# EasyEDA Pro project ProPrj_super_cap_ctrl_v1.0_2025-02-24.epro, schematic 控制原理图

## Sheets
1 MCU: Board Name: 控制下板v1.0; Create Date: 2024-10-04; Page Name: MCU; Project Name: h桥电路test_v1.0; Schematic Name: 控制原理图; Update Date: 2024-10-04; Company: 嘉立创EDA; Page Size: A4; Version: V1.0
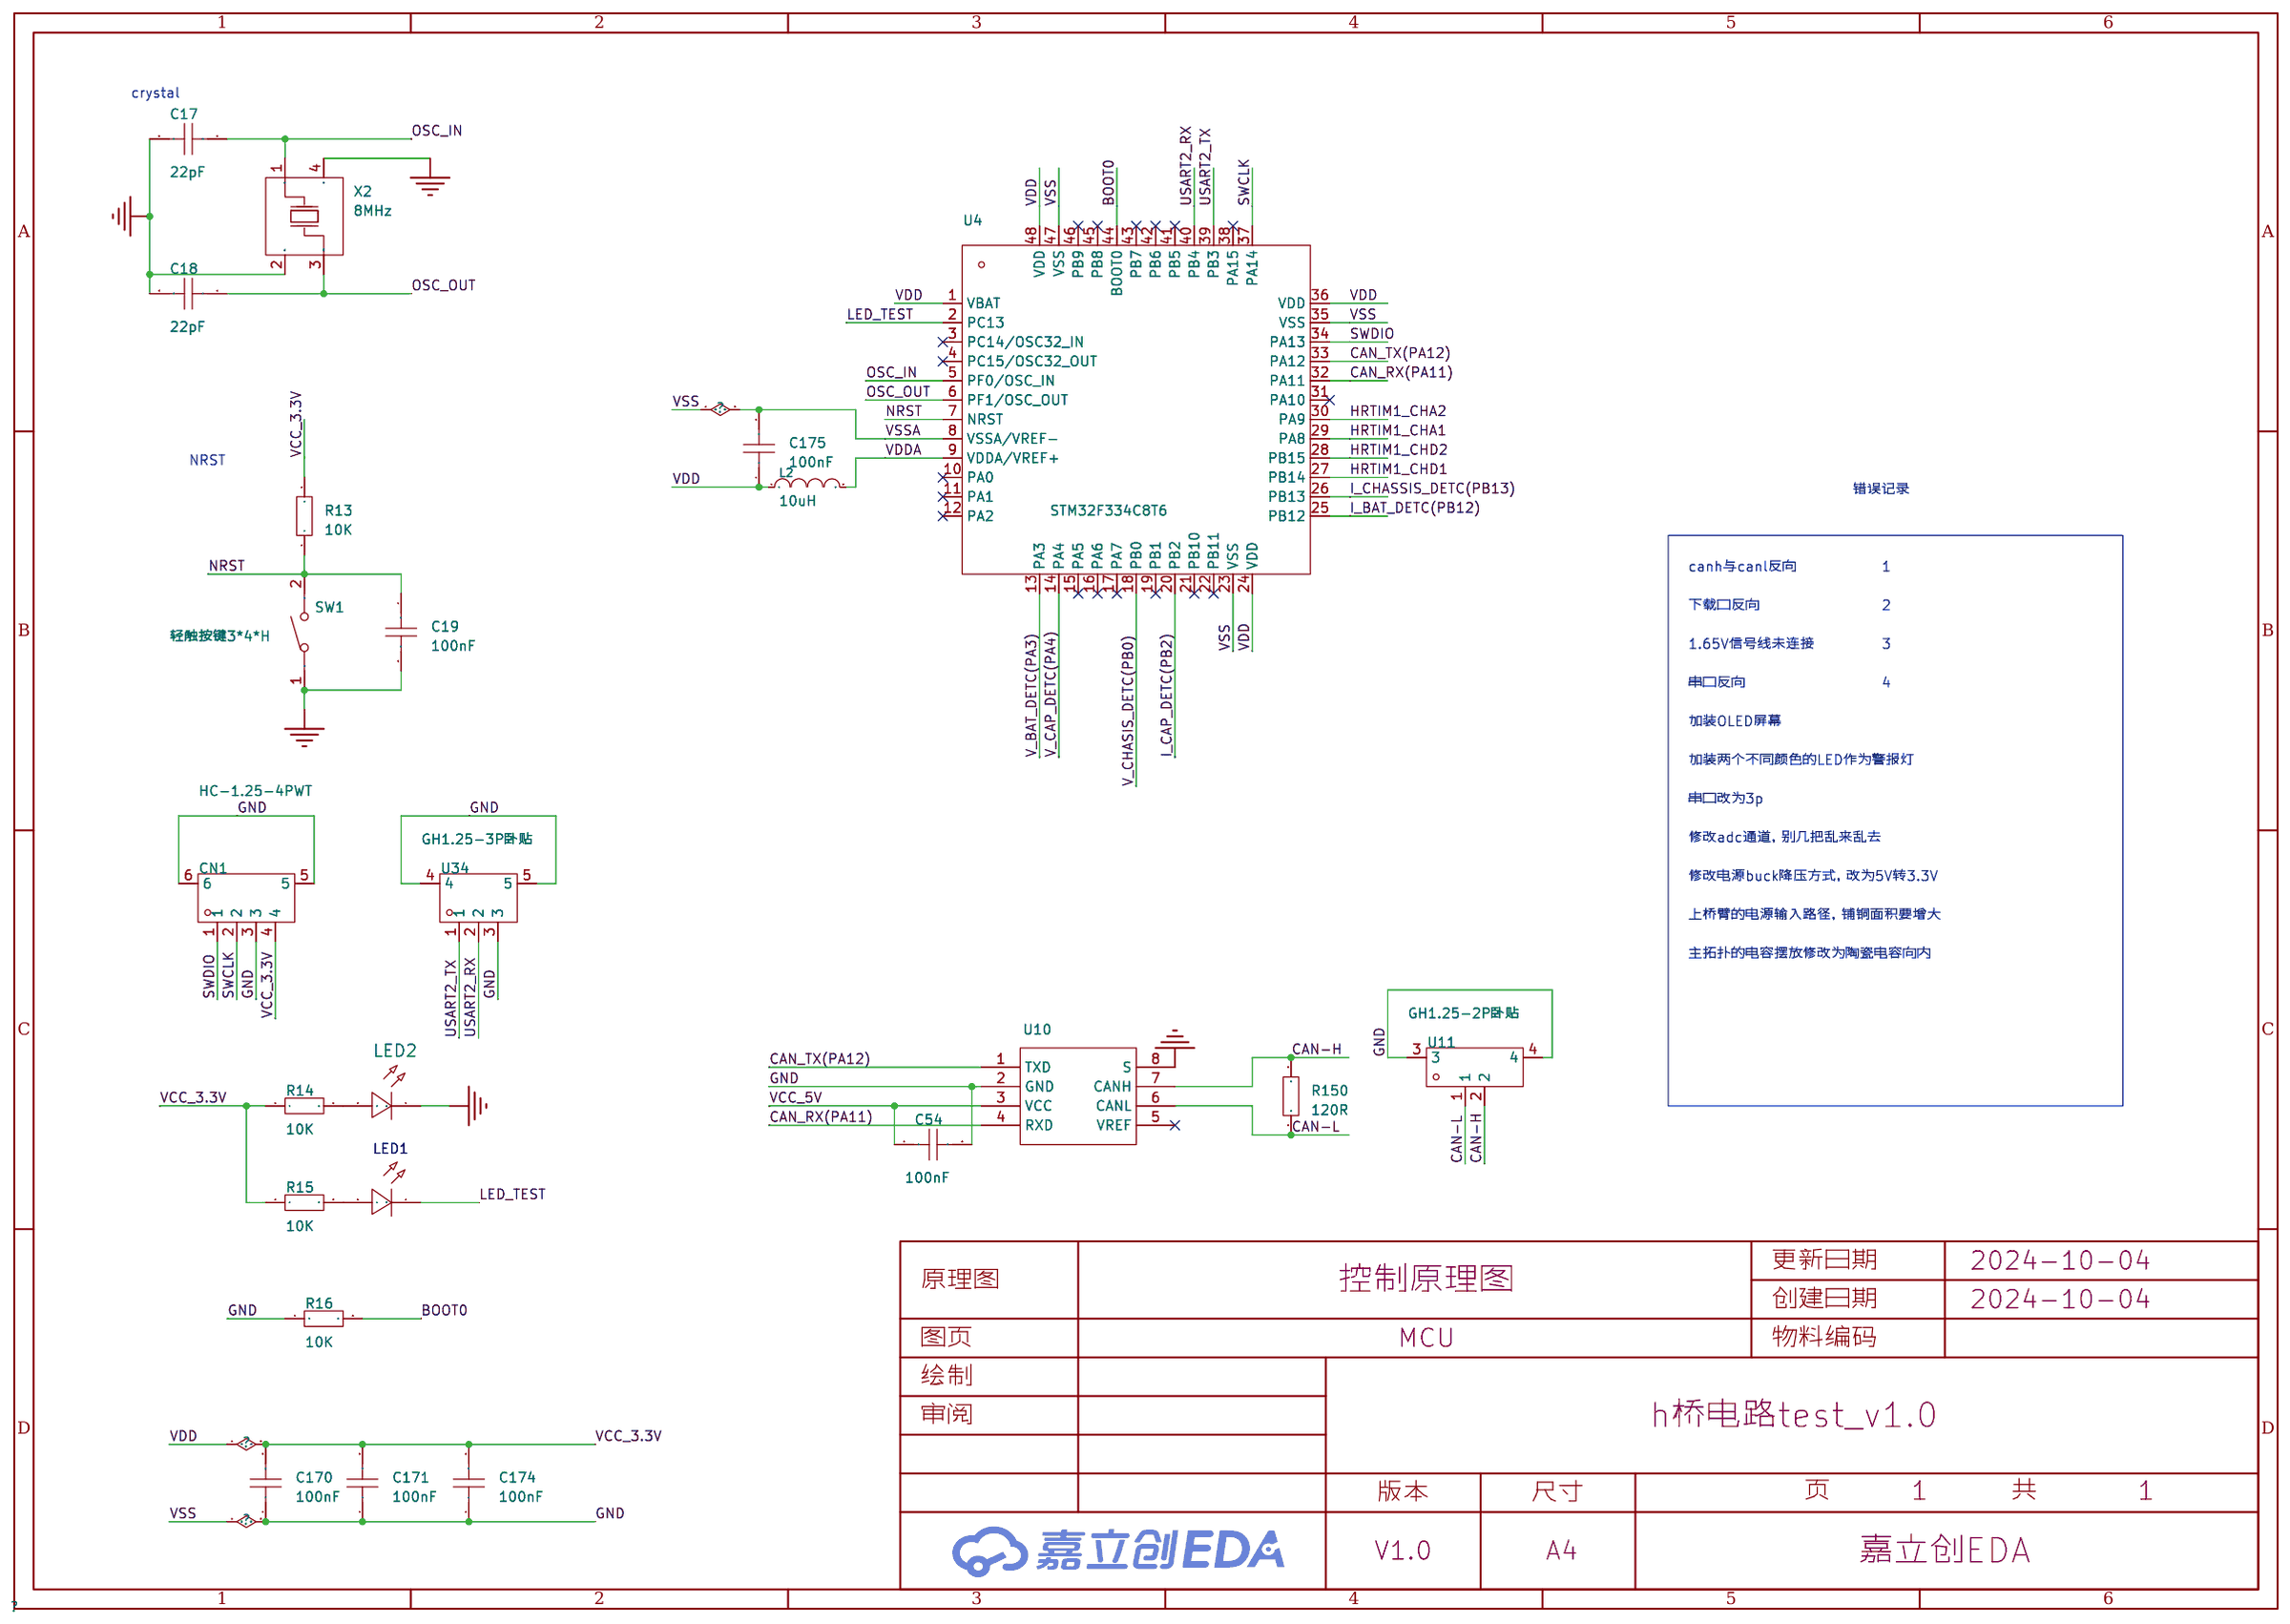
[diagram p5: MCU]
2 辅助电源: Create Date: 2024-10-22; Page Name: 辅助电源; Update Date: 2024-10-22
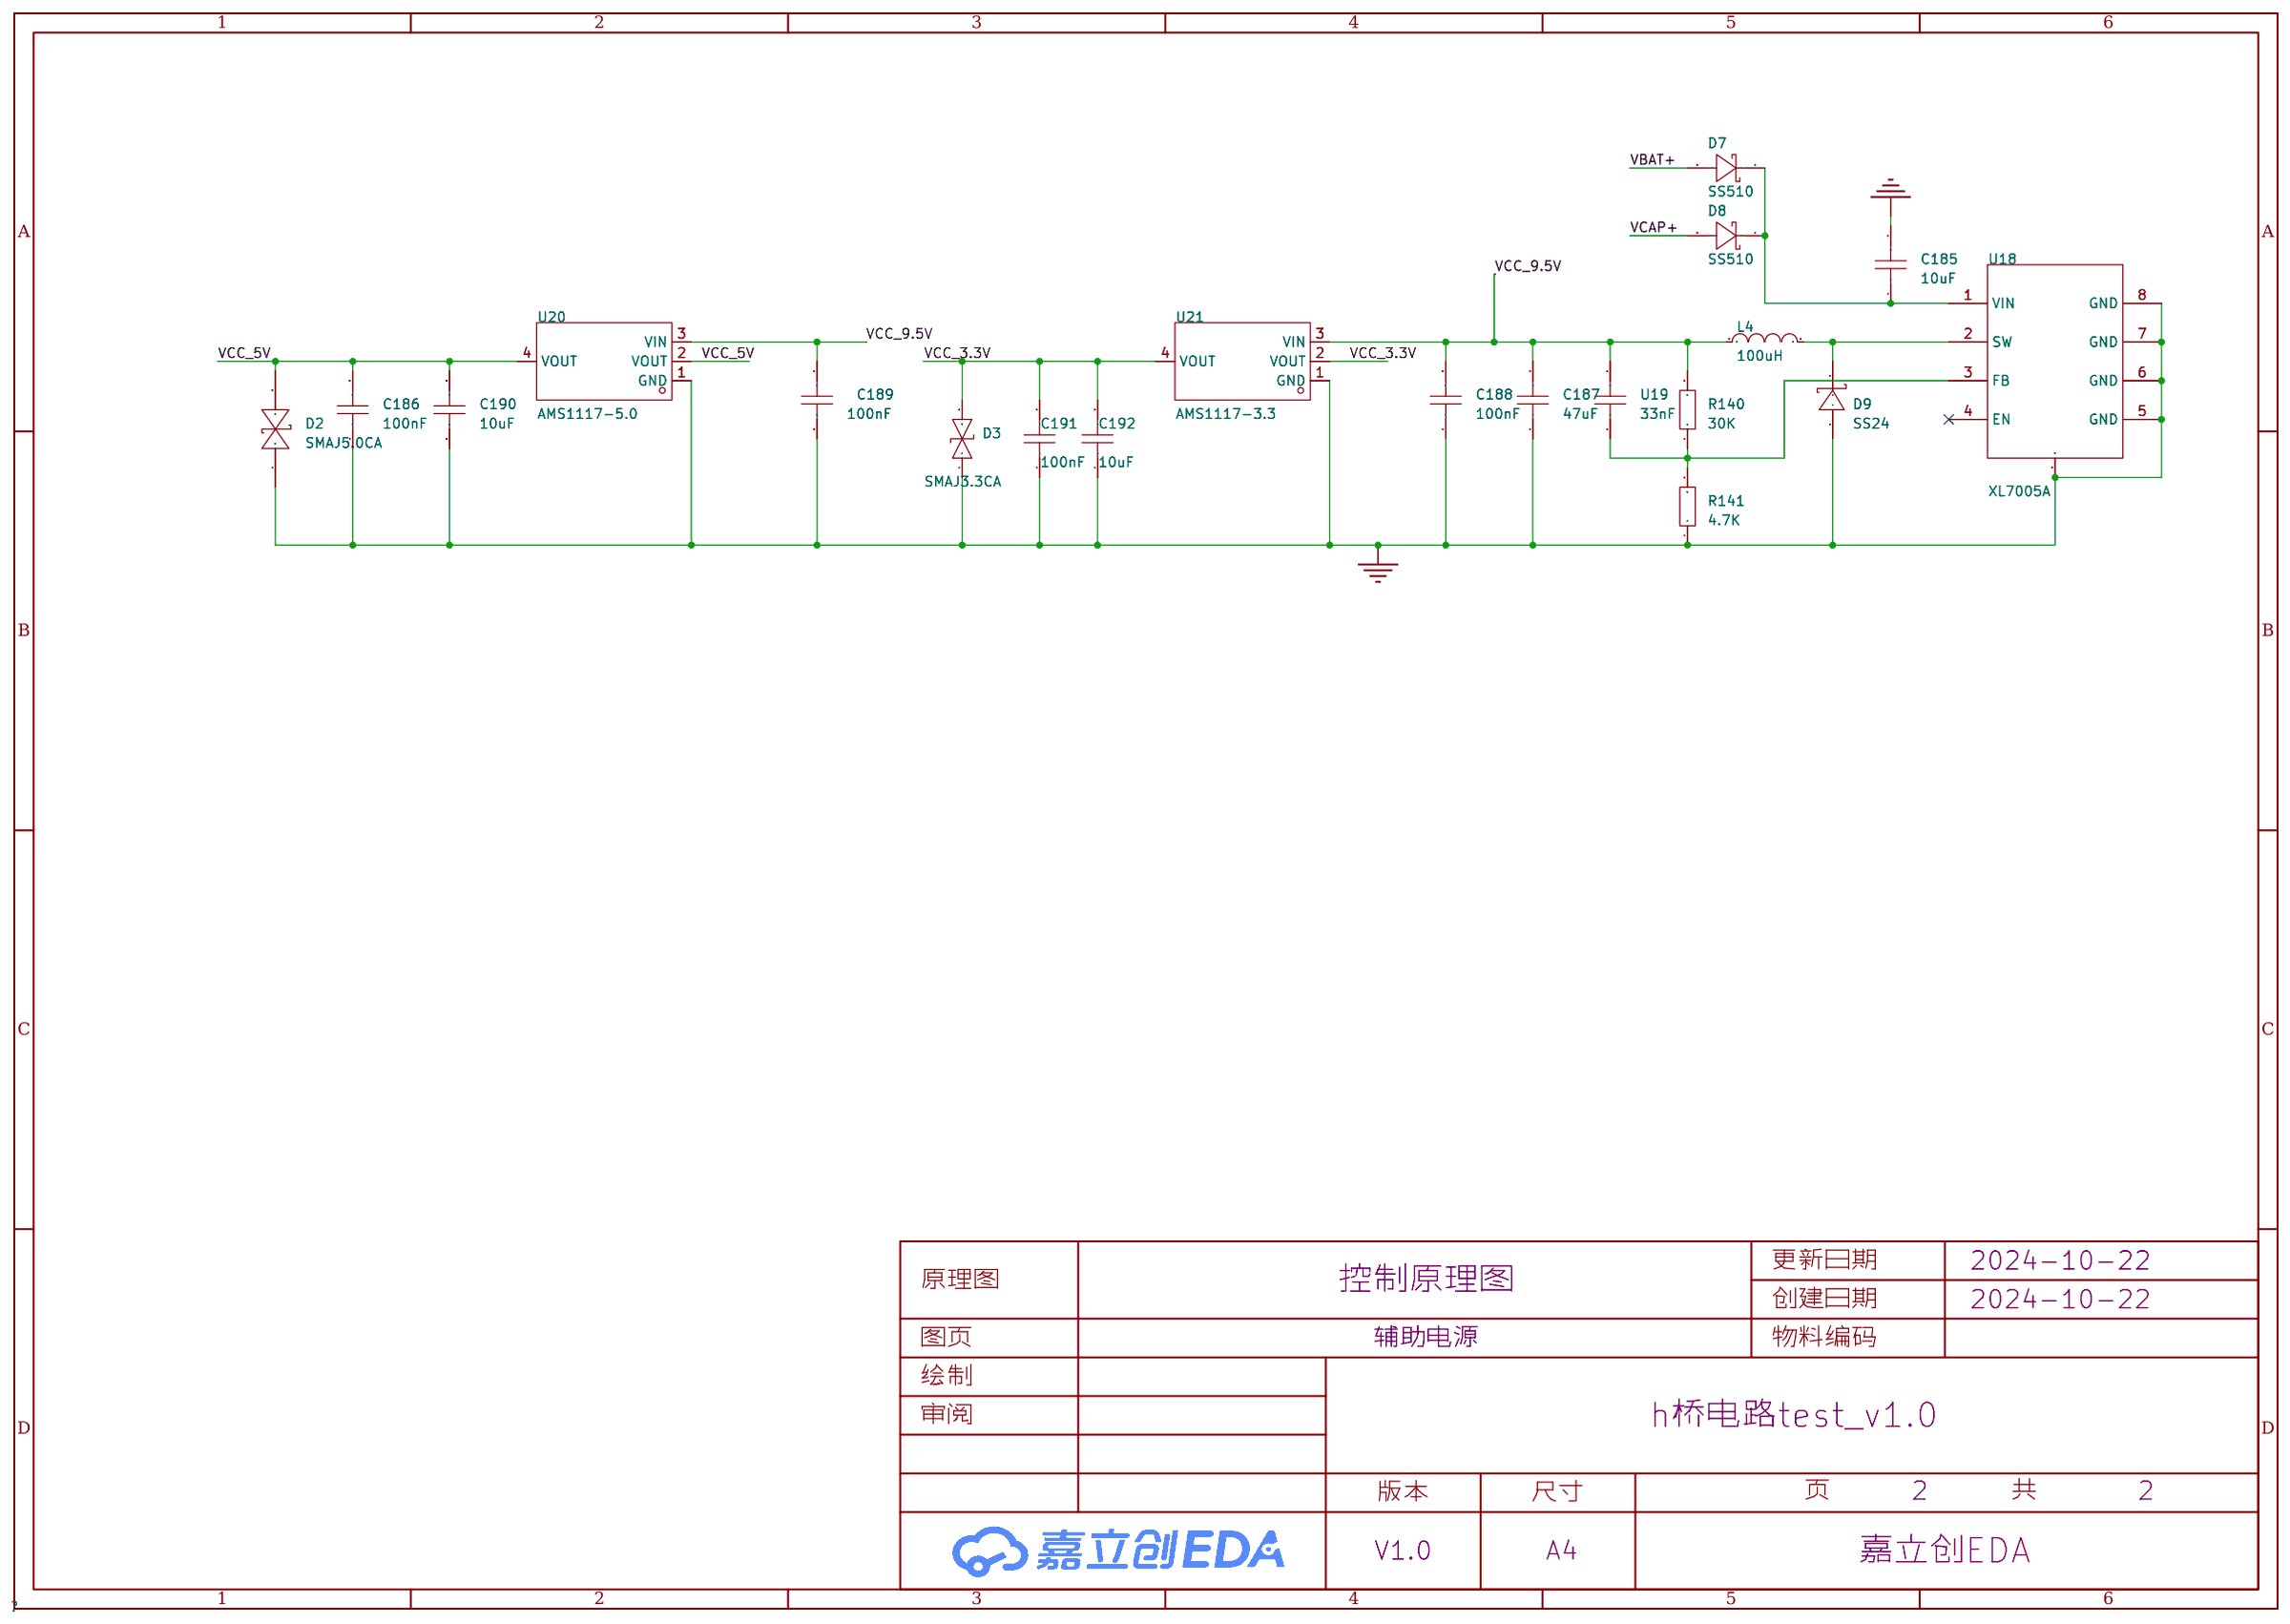
[diagram p6: 辅助电源]
3 信号调理: Board Name: 功率上板v1.0; Create Date: 2024-10-05; Page Name: 信号调理; Schematic Name: 功率原理图; Update Date: 2024-10-18; Page Size: A3
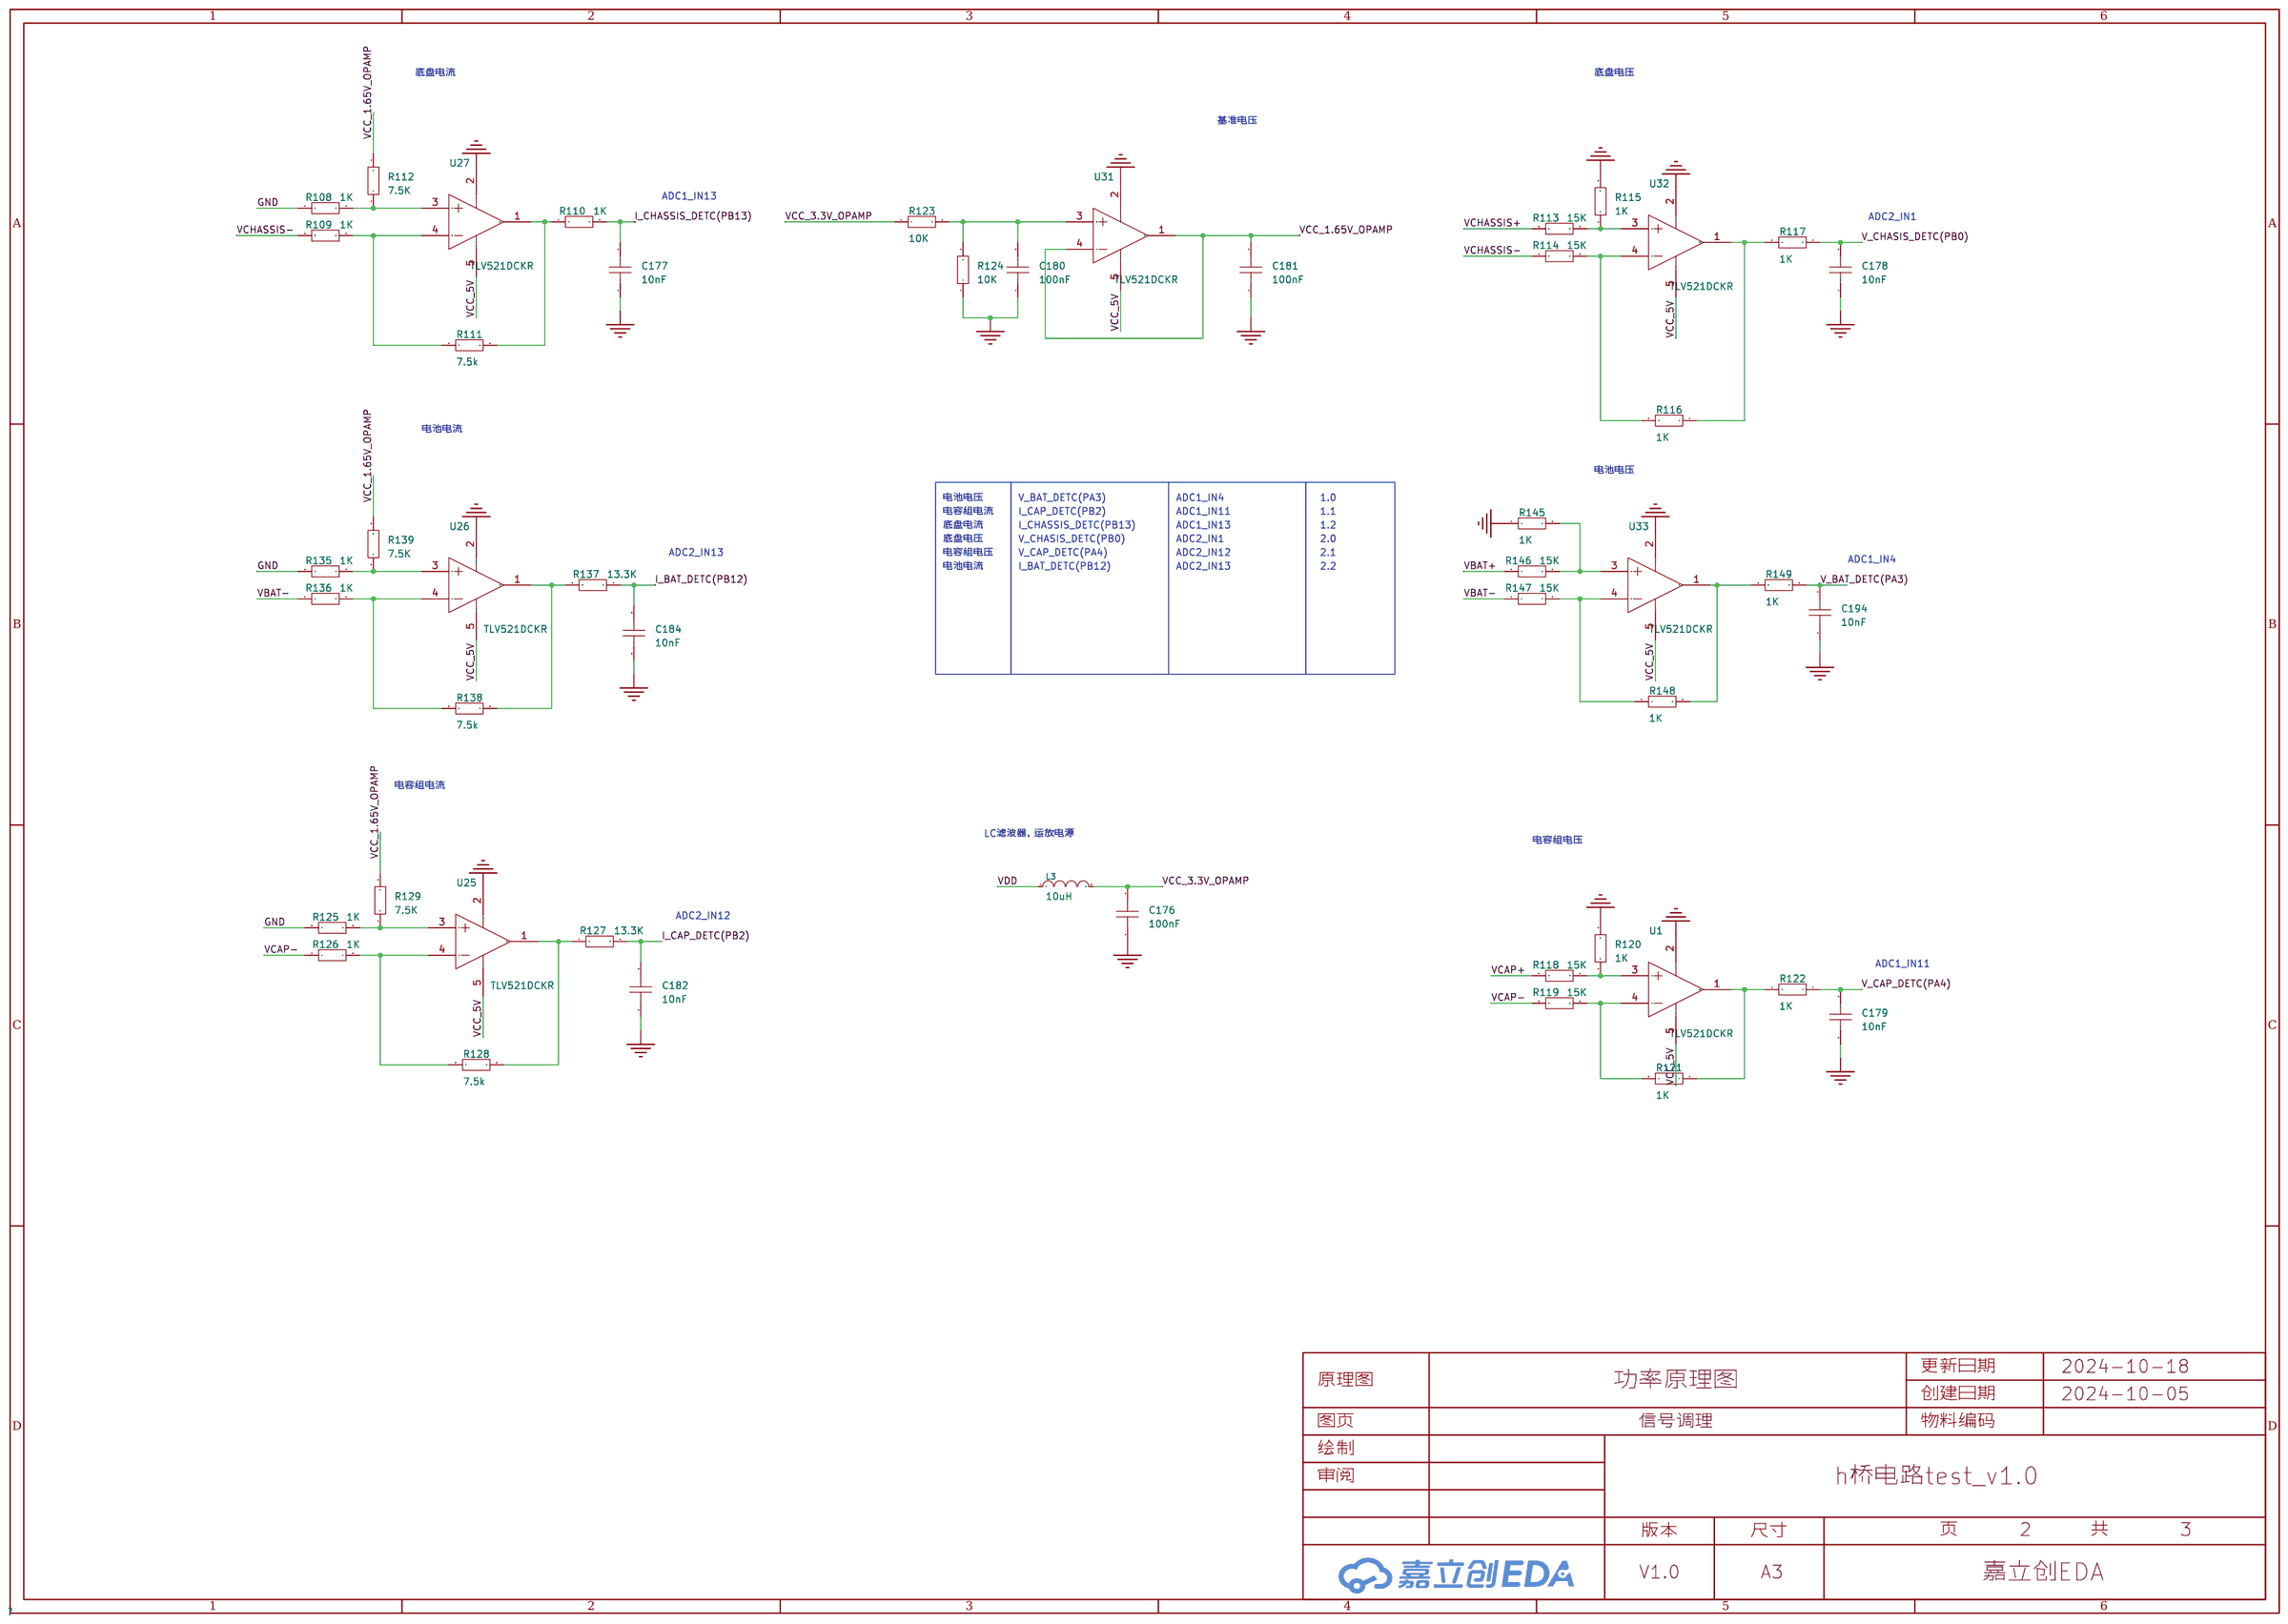
[diagram p7: 信号调理]

## Parts
sheet MCU
C17  22pF  [C0603]
C18  22pF  [C0603]
C19  100nF  [C0603]
C54  100nF  [C0603]
C170  100nF  [C0603]
C171  100nF  [C0603]
C174  100nF  [C0603]
C175  100nF  [C0603]
CN1  HC-1.25-4PWT  [CONN-SMD_4P-P1.25-HC-1.25-4PWT]
L2  10uH  [L0603]
LED1  -  [LED_0603]
LED2  -  [LED_0603]
R13  10K  [R0603]
R14  10K  [R0603]
R15  10K  [R0603]
R16  10K  [R0603]
R150  120R  [R0603]
SW1  轻触按键3*4*H  [SW-SMD_L4.0-W2.9-LS5.0]
U4  STM32F334C8T6  [LQFP-48_L7.0-W7.0-P0.50-LS9.0-BL]
U10  -  [SOIC-8_L5.0-W4.0-P1.27-LS6.0-BL]
U11  GH1.25-2P卧贴  [CONN-SMD_2P-P1.25_GH1.25-2P]
U34  GH1.25-3P卧贴  [CONN-SMD_GH1.25-3P]
X2  8MHz  [OSC-SMD_4P-L3.2-W2.5-BL]
sheet 信号调理
C176  100nF  [C0603]
C177  10nF  [C0603]
C178  10nF  [C0603]
C179  10nF  [C0603]
C180  100nF  [C0603]
C181  100nF  [C0603]
C182  10nF  [C0603]
C184  10nF  [C0603]
C194  10nF  [C0603]
L3  10uH  [L0603]
R108  1K  [R0603]
R109  1K  [R0603]
R110  1K  [R0603]
R111  7.5k  [R0603]
R112  7.5K  [R0603]
R113  15K  [R0603]
R114  15K  [R0603]
R115  1K  [R0603]
R116  1K  [R0603]
R117  1K  [R0603]
R118  15K  [R0603]
R119  15K  [R0603]
R120  1K  [R0603]
R121  1K  [R0603]
R122  1K  [R0603]
R123  10K  [R0603]
R124  10K  [R0603]
R125  1K  [R0603]
R126  1K  [R0603]
R127  13.3K  [R0603]
R128  7.5k  [R0603]
R129  7.5K  [R0603]
R135  1K  [R0603]
R136  1K  [R0603]
R137  13.3K  [R0603]
R138  7.5k  [R0603]
R139  7.5K  [R0603]
R145  1K  [R0603]
R146  15K  [R0603]
R147  15K  [R0603]
R148  1K  [R0603]
R149  1K  [R0603]
U1  TLV521DCKR  [SC-70-5_L2.1-W1.3-P0.65-LS2.1-BR]
U25  TLV521DCKR  [SC-70-5_L2.1-W1.3-P0.65-LS2.1-BR]
U26  TLV521DCKR  [SC-70-5_L2.1-W1.3-P0.65-LS2.1-BR]
U27  TLV521DCKR  [SC-70-5_L2.1-W1.3-P0.65-LS2.1-BR]
U31  TLV521DCKR  [SC-70-5_L2.1-W1.3-P0.65-LS2.1-BR]
U32  TLV521DCKR  [SC-70-5_L2.1-W1.3-P0.65-LS2.1-BR]
U33  TLV521DCKR  [SC-70-5_L2.1-W1.3-P0.65-LS2.1-BR]
sheet 辅助电源
C185  10uF  [C1206]
C186  100nF  [C0603]
C187  47uF  [C1206]
C188  100nF  [C0603]
C189  100nF  [C0603]
C190  10uF  [C0603]
C191  100nF  [C0603]
C192  10uF  [C0603]
D2  SMAJ5.0CA  [SMA_L4.4-W2.8-LS5.1-BI]
D3  SMAJ3.3CA  [SMA_L4.3-W2.6-LS5.1-BI]
D7  SS510  [SMB_L4.3-W3.6-LS5.4-RD]
D8  SS510  [SMB_L4.3-W3.6-LS5.4-RD]
D9  SS24  [SMA_L4.3-W2.6-LS5.2-RD]
L4  100uH  [IND-SMD_L4.0-W4.0_FNR40XXS]
R140  30K  [R0603]
R141  4.7K  [R0603]
U18  XL7005A  [SOIC-8_L4.9-W3.9-P1.27-LS6.0-BL-EP3.1-1]
U19  33nF  [C0603]
U20  AMS1117-5.0  [SOT-223_L6.5-W3.5-P2.30-LS7.0-BR]
U21  AMS1117-3.3  [SOT-223-3_L6.5-W3.4-P2.30-LS7.0-BR]

## Library data of the parts
C17-C19 C170 C171 C174-C182 C184-C192 C194 = CAP_0603: Supplier Footprint: 0603
C54 = CC0603KRX7R9BB104: 容值:100nF;精度:±10%;额定电压:50V;材质(温度系数):X7R;; LCSC Part Name: 100nF ±10% 50V; Supplier Part: C14663; Manufacturer: YAGEO(国巨); Supplier Footprint: 0603; JLCPCB Part Class: Basic Part; Datasheet: https://atta.szlcsc.com/upload/public/pdf/source/20180910/C282072_33301C7F631E79921B82A8DAC6BCC5B3.pdf; Supplier: LCSC; Tolerance: ±10%; Voltage Rated: 50V; Temperature Coefficient: X7R
CN1 = HC-1.25-4PWT: 插针结构:1x4P;间距:1.25mm;安装方式:卧贴;参考系列:-;总PIN数:4P;排数:1;每排PIN数:4;行距:-;额定电流:2A;触头材质:黄铜;触头镀层:锡;工作温度范围:-25℃~+85℃;; LCSC Part Name: 1x4P 间距:1.25mm 卧贴; Supplier Part: C2845381; Manufacturer: HCTL(华灿天禄); Supplier Footprint: SMD,P=1.25mm,卧贴; JLCPCB Part Class: 扩展库; Datasheet: https://atta.szlcsc.com/upload/public/pdf/source/20230707/D26CCCA63A4ED0B68E63A615510D7FF9.pdf; Supplier: LCSC; Pins Structure: 1x4P; Pitch: 1.25mm; Mounting Style: 卧贴; Number of Pins: 4P; Number of Rows: 1; Number of PINs Per Row: 4; Current Rating (Max): 2A; Contact Material: 黄铜; Contact Plating: 锡; Operating Temperature Range: -25℃~+85℃
L2 L3 = L_0603
LED1 = LED_0603-B: Supplier Footprint: 0603
LED2 = LED_0603-R: Supplier Footprint: 0603
R13-R16 R108-R129 R135-R141 R145-R150 = Res_0603: Supplier Footprint: 0603
SW1 = 轻触按键3*4*H: Supplier Part: C9900017573; Supplier Footprint: 轻触按键3*4*2.5; JLCPCB Part Class: 扩展库; Datasheet: https://atta.szlcsc.comnull; Supplier: LCSC
U4 = STM32F334C8T6: CPU内核:CM4;程序存储容量:64KB;RAM总容量:12KB;GPIO端口数量:37;工作电压范围:2V~3.6V;CPU最大主频:72MHz;程序存储器类型:FLASH;; Supplier Part: C99450; Manufacturer: ST(意法半导体); Supplier Footprint: LQFP-48(7x7); JLCPCB Part Class: 扩展库; Datasheet: https://atta.szlcsc.com/upload/public/pdf/source/20180105/C99450_15151501269081234225.pdf; Supplier: LCSC; CPU Core: CM4; Program Storage Size: 64KB; RAM Size: 12KB; GPIO Ports Number: 37; Operating Voltage Range: 2V~3.6V; CPU Maximum Speed: 72MHz; Program Memory Type: FLASH; Operating Temperature Range: -40℃~+85℃; ADC (Bit): 12bit; DAC (Bit): 12bit; Peripheral/Function: DMA；看门狗；看门狗; Watchdog: 有; Infrared Data Association: 有; Low-Voltage Detect: 有; Direct Memory Access: 有; Internal Oscillator: 有
U10 = TJA1050T/CM,118: 类型:收发器;协议类别:CAN总线;; Supplier Part: C6952; Manufacturer: NXP(恩智浦); Supplier Footprint: SOIC-8_150mil; JLCPCB Part Class: Basic Part; Datasheet: https://atta.szlcsc.com/upload/public/pdf/source/20140411/1457707042917.pdf; Supplier: LCSC; Type: 收发器; Protocol: CAN总线; Supply Voltage: 4.75V ~ 5.25V
U11 = GH1.25-2P卧贴: Supplier Part: C9900014668; JLCPCB Part Class: 扩展库; Supplier: LCSC
U34 = GH1.25-3P卧贴: Supplier Part: C9900014671; JLCPCB Part Class: 扩展库; Supplier: LCSC
X2 = X322525MOB4SI: 频率:25MHz;频率公差:±10ppm;负载电容:12pF;; LCSC Part Name: 25MHz ±10ppm 12pF YSX321SL; Supplier Part: C9006; Manufacturer: YXC(扬兴晶振); Supplier Footprint: SMD3225-4P; JLCPCB Part Class: 基础库; Datasheet: https://atta.szlcsc.com/upload/public/pdf/source/20210329/C112971_1F611BDC486E193C1706F6D8EB5AA189.pdf; Supplier: LCSC; Crystal Type: 贴片无源晶振; Frequency Tolerance: ±10ppm; Frequency Stability: ±30ppm; Load Capacitance: 12pF; Operating Temperature: -40℃~+85℃
U1 U25-U27 U31-U33 = TLV521DCKR: 放大器数:单路;增益带宽积(GBP):6kHz;输入偏置电流(Ib):1pA;压摆率(SR):0.0025V/us;带宽(-3db):-;轨到轨:-;; Supplier Part: C655085; Manufacturer: TI(德州仪器); Supplier Footprint: SC-70-5; JLCPCB Part Class: 扩展库; Datasheet: https://www.ti.com/cn/lit/gpn/tlv521; Supplier: LCSC; Number of Circuits: 单路; Gain Bandwidth Product(GBP): 6kHz; Current - Input Bias(Ib): 1pA; Slew Rate(SR): 0.0025V/us; Output Current: 12mA; Operating Temperature: -40℃~+125℃
D2 = SMAJ5.0CA: 反向截止电压(Vrwm):5V;最大钳位电压:9.2V;峰值脉冲电流(Ipp)@10/1000us:43.5A;击穿电压:6.4V;; LCSC Part Name: 双向TVS 5V截止 43.5A峰值脉冲; Supplier Part: C356748; Manufacturer: JJW(捷捷微); Supplier Footprint: SMA(DO-214AC); JLCPCB Part Class: 扩展库; Datasheet: https://atta.szlcsc.com/upload/public/pdf/source/20190118/C364660_B64EB57815AD6306F3CC88F8ECD7A3CF.pdf; Supplier: LCSC; Reverse Stand-Off Voltage (Vrwm): 5V; Maximum Clamping Voltage: 9.2V; Peak Pulse Current (Ipp)@10/1000us: 43.5A; Breakdown Voltage: 6.4V; Type: TVS
D3 = SMAJ3.3CA: Supplier Part: C9900005096; Supplier Footprint: SMA; JLCPCB Part Class: 扩展库; Supplier: LCSC
D7 D8 = SS510: 二极管配置:独立式;正向压降(Vf):850mV@5A;直流反向耐压(Vr):100V;平均整流电流(Io):5A;; LCSC Part Name: 电压:100V 电流:5A; Supplier Part: C2898359; Manufacturer: YFW(佑风微); Supplier Footprint: SMB; JLCPCB Part Class: 扩展库; Datasheet: https://atta.szlcsc.com/upload/public/pdf/source/20211008/1A631543609D8D3463D9A042ED2C10D9.pdf; Supplier: LCSC; Diode Configuration: 独立式; Forward Voltage (Vf@If): 850mV@5A; Reverse Voltage (Vr): 100V; Average Rectified Current (Io): 5A; Reverse Leakage Current (Ir): 300uA@100V
D9 = SS24: 正向压降(Vf):550mV@2A;直流反向耐压(Vr):40V;平均整流电流(Io):2A;; LCSC Part Name: 电压:40V 电流:2A; Supplier Part: C13444; Supplier Footprint: SMA(DO-214AC); JLCPCB Part Class: 扩展库; Supplier: LCSC; Forward Voltage (Vf@If): 550mV@2A; Reverse Voltage (Vr): 40V; Average Rectified Current (Io): 2A
L4 = FNR4030S470MT: 电感值:47uH;精度:±20%;额定电流:800mA;饱和电流(Isat):1A;; LCSC Part Name: 47uH ±20% 1A; Supplier Part: C167888; Manufacturer: cjiang(长江微电); Supplier Footprint: SMD,4x4mm; JLCPCB Part Class: 扩展库; Datasheet: https://atta.szlcsc.com/upload/public/pdf/source/20190327/C167925_9EFF0AABC4CA629C2CC95961DBF7D39D.pdf; Supplier: LCSC; Tolerance: ±20%; Rated Current: 800mA; Saturation Current (Isat): 1A; DC Resistance (DCR): 579mΩ
U18 = XL7005A: 功能类型:降压型;输入电压:-;输出电流(最大值):-;; Supplier Part: C50848; Manufacturer: XLSEMI(芯龙); Supplier Footprint: SOIC-8-EP; JLCPCB Part Class: 扩展库; Datasheet: https://atta.szlcsc.com/upload/public/pdf/source/20150821/1457707346919.pdf; Supplier: LCSC; Function: 降压型; Switch tube (built-in/external): 内置
U19 = C3216JB1C336M160AB: 容值:33uF;精度:±20%;额定电压:16V;材质(温度系数):JB;; LCSC Part Name: 33uF ±20% 16V; Supplier Part: C3842845; Manufacturer: TDK; Supplier Footprint: 1206; JLCPCB Part Class: 扩展库; Datasheet: https://atta.szlcsc.com/upload/public/pdf/source/20230606/A83975C7E70EF5AFCD4A17254ABD78F2.pdf; Supplier: LCSC; Tolerance: ±20%; Voltage Rated: 16V; Temperature Coefficient: JB
U20 = AMS1117-5.0_C6187: 输出类型:固定;最大输入电压:12V;输出电压:5V;最大输出电流:1A;电源纹波抑制比(PSRR):68dB@(120Hz);输出极性:正极;; LCSC Part Name: 输入12V 输出5V 1A; Supplier Part: C6187; Manufacturer: AMS; Supplier Footprint: SOT-223; JLCPCB Part Class: 基础库; Datasheet: https://atta.szlcsc.com/upload/public/pdf/source/20230918/E4B716057EE82179D88E8A0894830D59.pdf; Supplier: LCSC; Output Type: 固定; Maximum Input Voltage: 12V; Output Voltage: 5V; MAX Output Current: 1A; Power Supply Rejection Ratio (PSRR): 68dB@(120Hz); Dropout Voltage: 1.3V@(1A); Output Polarity: 正极; Number of Outputs: 1
U21 = AMS1117-3.3_C6186: 输出类型:固定;最大输入电压:-;输出电压:3.3V;最大输出电流:1A;电源纹波抑制比(PSRR):72dB@(120Hz);输出极性:正极;; LCSC Part Name: 输出3.3V 1A; Supplier Part: C6186; Manufacturer: AMS; Supplier Footprint: SOT-223-3; JLCPCB Part Class: 基础库; Datasheet: https://atta.szlcsc.com/upload/public/pdf/source/20180727/C6186_7A095716F0823C02F1997A905E26C086.pdf; Supplier: LCSC; Output Type: 固定; Output Voltage: 3.3V; MAX Output Current: 1A; Power Supply Rejection Ratio (PSRR): 72dB@(120Hz); Dropout Voltage: 1.3V@(800mA); Output Polarity: 正极; Number of Outputs: 1

## Nets
GND: C17.2 C18.2 C19.2 C54.2 C170.1 C171.1 C174.1 C175.2 C176.1 C177.1 C178.1 C179.1 C180.1 C181.1 C182.1 C184.1 C185.2 C186.1 C187.1 C188.1 C189.1 C190.1 C191.1 C192.1 C194.1 CN1.3 CN1.5 CN1.6 D2.1 D3.1 D9.2(A) LED2.1(C) R16.1 R108.1 R115.2 R120.2 R124.1 R125.1 R135.1 R141.1 R145.1 SW1.1 U1.2(V-) U4.8(VSSA/VREF-) U4.23(VSS) U4.35(VSS) U4.47(VSS) U10.2(GND) U10.8(S) U11.3 U11.4 U18.5(GND) U18.6(GND) U18.7(GND) U18.8(GND) U18.9 U20.1(GND) U21.1(GND) U25.2(V-) U26.2(V-) U27.2(V-) U31.2(V-) U32.2(V-) U33.2(V-) U34.3 U34.4 U34.5 X2.2(GND) X2.4(GND)
VBAT+: D7.2(A) R146.1
VBAT-: R136.1 R147.1
VCC_1.65V_OPAMP: C181.2 R112.2 R129.2 R139.2 U31.1(OUT) U31.4(IN-)
VCC_3.3V: C170.2 C171.2 C174.2 C175.1 C191.2 C192.2 CN1.4 D3.2 L2.1 L3.1 R13.2 R14.1 R15.1 U4.1(VBAT) U4.24(VDD) U4.36(VDD) U4.48(VDD) U21.2(VOUT) U21.4(VOUT)
VCC_3.3V_OPAMP: C176.2 L3.2 R123.1
VCC_5V: C54.1 C186.2 C190.2 D2.2 U1.5(V+) U10.3(VCC) U20.2(VOUT) U20.4(VOUT) U25.5(V+) U26.5(V+) U27.5(V+) U31.5(V+) U32.5(V+) U33.5(V+)
VCC_9.5V: C187.2 C188.2 C189.2 L4.1 R140.2 U19.2 U20.3(VIN) U21.3(VIN)
VDDA: L2.2 U4.9(VDDA/VREF+)
BOOT0: R16.2 U4.44(BOOT0)
CAN-H: R150.2 U10.7(CANH) U11.2
CAN-L: R150.1 U10.6(CANL) U11.1
CAN_RX(PA11): U4.32(PA11) U10.4(RXD)
CAN_TX(PA12): U4.33(PA12) U10.1(TXD)
HRTIM1_CHA1: U4.29(PA8)
HRTIM1_CHA2: U4.30(PA9)
HRTIM1_CHD1: U4.27(PB14)
HRTIM1_CHD2: U4.28(PB15)
I_BAT_DETC(PB12): C184.2 R137.2 U4.25(PB12)
I_CAP_DETC(PB2): C182.2 R127.2 U4.20(PB2)
I_CHASSIS_DETC(PB13): C177.2 R110.2 U4.26(PB13)
LED_TEST: LED1.1(C) U4.2(PC13)
NRST: C19.1 R13.1 SW1.2 U4.7(NRST)
OSC_IN: C17.1 U4.5(PF0/OSC_IN) X2.1(OSC1)
OSC_OUT: C18.1 U4.6(PF1/OSC_OUT) X2.3(OSC2)
SWCLK: CN1.2 U4.37(PA14)
SWDIO: CN1.1 U4.34(PA13)
USART2_RX: U4.40(PB4) U34.2
USART2_TX: U4.39(PB3) U34.1
V_BAT_DETC(PA3): C194.2 R149.2 U4.13(PA3)
V_CAP_DETC(PA4): C179.2 R122.1 U4.14(PA4)
V_CHASIS_DETC(PB0): C178.2 R117.1 U4.18(PB0)
VCAP+: D8.2(A) R118.1
VCAP-: R119.1 R126.1
VCHASSIS+: R113.1
VCHASSIS-: R109.1 R114.1
$1N1104: LED2.2(A) R14.2
$1N1105: LED1.2(A) R15.2
$2N1564: R108.2 R112.1 U27.3(IN+)
$2N1568: R109.2 R111.1 U27.4(IN-)
$2N1569: R110.1 R111.2 U27.1(OUT)
$2N1589: R125.2 R129.1 U25.3(IN+)
$2N1593: R126.2 R128.1 U25.4(IN-)
$2N1594: R127.1 R128.2 U25.1(OUT)
$2N1597: R135.2 R139.1 U26.3(IN+)
$2N1601: R136.2 R138.1 U26.4(IN-)
$2N1602: R137.1 R138.2 U26.1(OUT)
$3N707: R140.1 R141.2 U18.3(FB) U19.1
Net-(C180-2): C180.2 R123.2 R124.2 U31.3(IN+)
Net-(C185-1): C185.1 D7.1(K) D8.1(K) U18.1(VIN)
Net-(D9-1): D9.1(K) L4.2 U18.2(SW)
Net-(R113-2): R113.2 R115.1 U32.3(IN+)
Net-(R114-2): R114.2 R116.2 U32.4(IN-)
Net-(R116-1): R116.1 R117.2 U32.1(OUT)
Net-(R118-2): R118.2 R120.1 U1.3(IN+)
Net-(R119-2): R119.2 R121.2 U1.4(IN-)
Net-(R121-1): R121.1 R122.2 U1.1(OUT)
Net-(R145-2): R145.2 R146.2 U33.3(IN+)
Net-(R147-2): R147.2 R148.1 U33.4(IN-)
Net-(R148-2): R148.2 R149.1 U33.1(OUT)

Not connected (* = marked no-connect by the designer): U4 3(PC14/OSC32_IN)* 4(PC15/OSC32_OUT)* 10(PA0)* 11(PA1)* 12(PA2)* 15(PA5)* 16(PA6)* 17(PA7)* 19(PB1)* 21(PB10)* 22(PB11)* 31(PA10)* 38(PA15)* 41(PB5)* 42(PB6)* 43(PB7)* 45(PB8)* 46(PB9)*; U10 5(VREF)*; U18 4(EN)*

## Notes on the sheets
sheet 1
- crystal
- NRST
- 错误记录
- canh与canl反向
- 1
- 下载口反向
- 2
- 1.65V信号线未连接
- 3
- 串口反向
- 4
- 加装OLED屏幕
- 加装两个不同颜色的LED作为警报灯
- 串口改为3p
- 修改adc通道，别几把乱来乱去
- 修改电源buck降压方式，改为5V转3.3V
- 上桥臂的电源输入路径，铺铜面积要增大
- 主拓扑的电容摆放修改为陶瓷电容向内
sheet 3
- 底盘电流
- 底盘电压
- 基准电压
- ADC1_IN13
- ADC2_IN1
- 电池电流
- 电池电压
- 电池电压
- V_BAT_DETC(PA3)
- ADC1_IN4
- 1.0
- 电容组电流
- I_CAP_DETC(PB2)
- ADC1_IN11
- 1.1
- 底盘电流
- I_CHASSIS_DETC(PB13)
- ADC1_IN13
- 1.2
- 底盘电压
- V_CHASIS_DETC(PB0)
- ADC2_IN1
- 2.0
- ADC2_IN13
- 电容组电压
- V_CAP_DETC(PA4)
- ADC2_IN12
- 2.1
- ADC1_IN4
- 电池电流
- I_BAT_DETC(PB12)
- ADC2_IN13
- 2.2
- 电容组电流
- LC滤波器，运放电源
- 电容组电压
- ADC2_IN12
- ADC1_IN11
